# EAGLE design piezo-driver_v0.4-R001 (EAGLE 6.5.0)
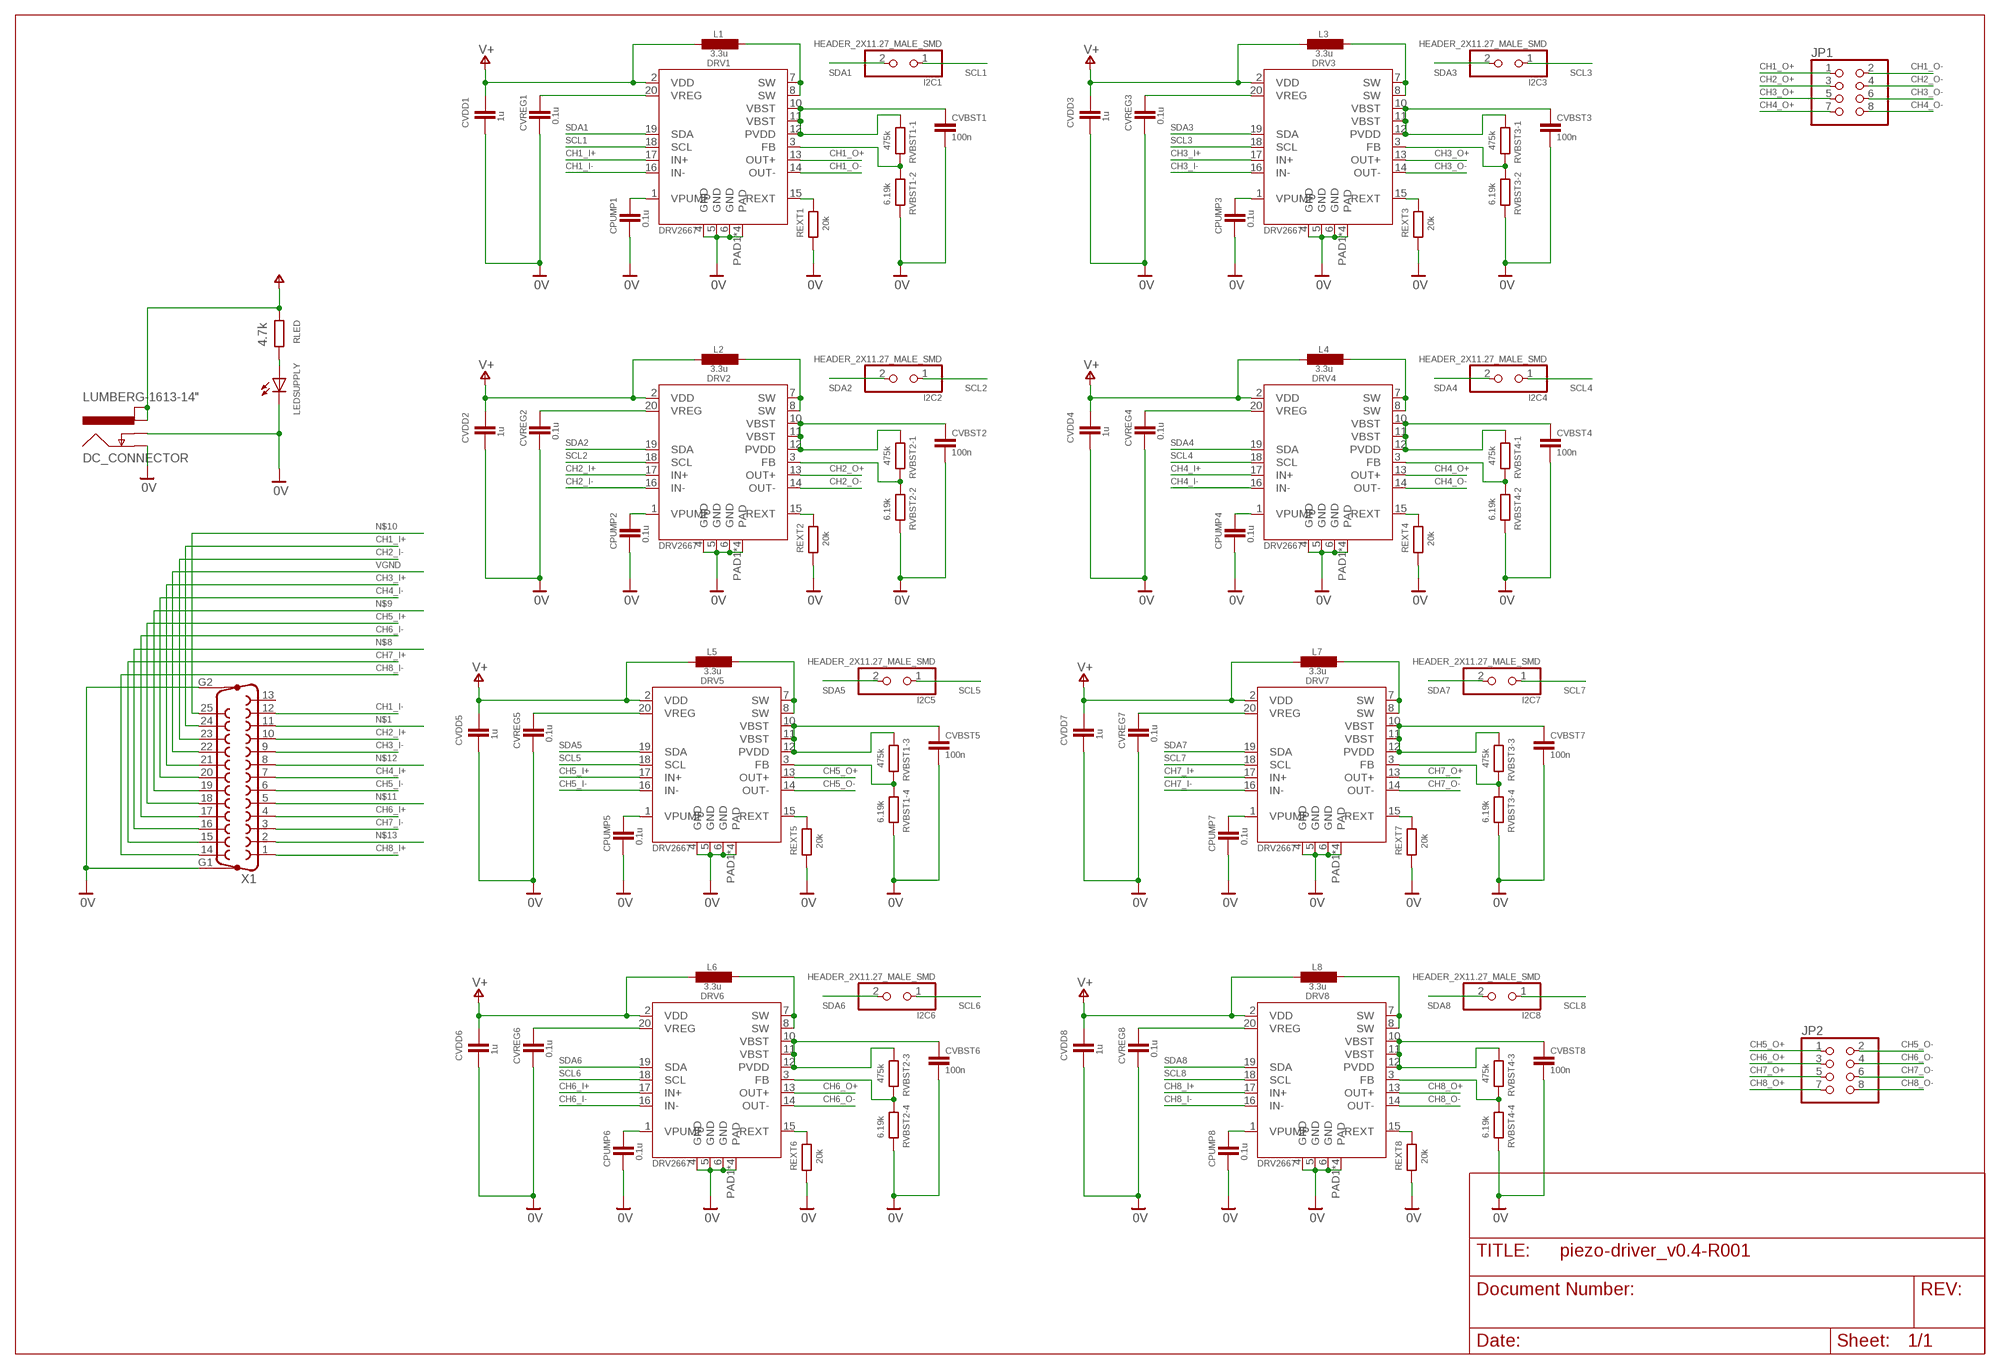
[diagram p0: schematic, sheet 1]

## Parts
CPUMP1  0.1u  C-EUC0805  [C0805]
CPUMP2  0.1u  C-EUC0805  [C0805]
CPUMP3  0.1u  C-EUC0805  [C0805]
CPUMP4  0.1u  C-EUC0805  [C0805]
CPUMP5  0.1u  C-EUC0805  [C0805]
CPUMP6  0.1u  C-EUC0805  [C0805]
CPUMP7  0.1u  C-EUC0805  [C0805]
CPUMP8  0.1u  C-EUC0805  [C0805]
CVBST1  100n  C-EUC0805  [C0805]
CVBST2  100n  C-EUC0805  [C0805]
CVBST3  100n  C-EUC0805  [C0805]
CVBST4  100n  C-EUC0805  [C0805]
CVBST5  100n  C-EUC0805  [C0805]
CVBST6  100n  C-EUC0805  [C0805]
CVBST7  100n  C-EUC0805  [C0805]
CVBST8  100n  C-EUC0805  [C0805]
CVDD1  1u  C-EUC0805  [C0805]
CVDD2  1u  C-EUC0805  [C0805]
CVDD3  1u  C-EUC0805  [C0805]
CVDD4  1u  C-EUC0805  [C0805]
CVDD5  1u  C-EUC0805  [C0805]
CVDD6  1u  C-EUC0805  [C0805]
CVDD7  1u  C-EUC0805  [C0805]
CVDD8  1u  C-EUC0805  [C0805]
CVREG1  0.1u  C-EUC0805  [C0805]
CVREG2  0.1u  C-EUC0805  [C0805]
CVREG3  0.1u  C-EUC0805  [C0805]
CVREG4  0.1u  C-EUC0805  [C0805]
CVREG5  0.1u  C-EUC0805  [C0805]
CVREG6  0.1u  C-EUC0805  [C0805]
CVREG7  0.1u  C-EUC0805  [C0805]
CVREG8  0.1u  C-EUC0805  [C0805]
DC_CONNECTOR  LUMBERG-1613-14"  [LUMBERG-1613_14]
DRV1  DRV2667QFN  [QFN400X400]
DRV2  DRV2667QFN  [QFN400X400]
DRV3  DRV2667QFN  [QFN400X400]
DRV4  DRV2667QFN  [QFN400X400]
DRV5  DRV2667QFN  [QFN400X400]
DRV6  DRV2667QFN  [QFN400X400]
DRV7  DRV2667QFN  [QFN400X400]
DRV8  DRV2667QFN  [QFN400X400]
I2C1  HEADER_2X11.27_MALE_SMD  [2X01_1.27_SMD]
I2C2  HEADER_2X11.27_MALE_SMD  [2X01_1.27_SMD]
I2C3  HEADER_2X11.27_MALE_SMD  [2X01_1.27_SMD]
I2C4  HEADER_2X11.27_MALE_SMD  [2X01_1.27_SMD]
I2C5  HEADER_2X11.27_MALE_SMD  [2X01_1.27_SMD]
I2C6  HEADER_2X11.27_MALE_SMD  [2X01_1.27_SMD]
I2C7  HEADER_2X11.27_MALE_SMD  [2X01_1.27_SMD]
I2C8  HEADER_2X11.27_MALE_SMD  [2X01_1.27_SMD]
JP1  PINHD-2X4/90  [2X04/90]
JP2  PINHD-2X4/90  [2X04/90]
L1  3.3u  L-EUL3225M  [L3225M]
L2  3.3u  L-EUL3225M  [L3225M]
L3  3.3u  L-EUL3225M  [L3225M]
L4  3.3u  L-EUL3225M  [L3225M]
L5  3.3u  L-EUL3225M  [L3225M]
L6  3.3u  L-EUL3225M  [L3225M]
L7  3.3u  L-EUL3225M  [L3225M]
L8  3.3u  L-EUL3225M  [L3225M]
LEDSUPPLY  LED0603  [LED-0603]
REXT1  20k  R-EU_R0805  [R0805]
REXT2  20k  R-EU_R0805  [R0805]
REXT3  20k  R-EU_R0805  [R0805]
REXT4  20k  R-EU_R0805  [R0805]
REXT5  20k  R-EU_R0805  [R0805]
REXT6  20k  R-EU_R0805  [R0805]
REXT7  20k  R-EU_R0805  [R0805]
REXT8  20k  R-EU_R0805  [R0805]
RLED  4.7k  R-EU_R0805  [R0805]
RVBST1-1  475k  R-EU_R0805  [R0805]
RVBST1-2  6.19k  R-EU_R0805  [R0805]
RVBST1-3  475k  R-EU_R0805  [R0805]
RVBST1-4  6.19k  R-EU_R0805  [R0805]
RVBST2-1  475k  R-EU_R0805  [R0805]
RVBST2-2  6.19k  R-EU_R0805  [R0805]
RVBST2-3  475k  R-EU_R0805  [R0805]
RVBST2-4  6.19k  R-EU_R0805  [R0805]
RVBST3-1  475k  R-EU_R0805  [R0805]
RVBST3-2  6.19k  R-EU_R0805  [R0805]
RVBST3-3  475k  R-EU_R0805  [R0805]
RVBST3-4  6.19k  R-EU_R0805  [R0805]
RVBST4-1  475k  R-EU_R0805  [R0805]
RVBST4-2  6.19k  R-EU_R0805  [R0805]
RVBST4-3  475k  R-EU_R0805  [R0805]
RVBST4-4  6.19k  R-EU_R0805  [R0805]
X1  F25HP  [F25HP]

## Nets
0V: CPUMP1.2 CPUMP2.2 CPUMP3.2 CPUMP4.2 CPUMP5.2 CPUMP6.2 CPUMP7.2 CPUMP8.2 CVBST1.2 CVBST2.2 CVBST3.2 CVBST4.2 CVBST5.2 CVBST6.2 CVBST7.2 CVBST8.2 CVDD1.2 CVDD2.2 CVDD3.2 CVDD4.2 CVDD5.2 CVDD6.2 CVDD7.2 CVDD8.2 CVREG1.2 CVREG2.2 CVREG3.2 CVREG4.2 CVREG5.2 CVREG6.2 CVREG7.2 CVREG8.2 DC_CONNECTOR.1(GND) DC_CONNECTOR.2(GND_INS) DRV1.4(GND) DRV1.5(GND) DRV1.6(GND) DRV1.PAD1(PAD) DRV1.PAD2(PAD) DRV1.PAD3(PAD) DRV1.PAD4(PAD) DRV2.4(GND) DRV2.5(GND) DRV2.6(GND) DRV2.PAD1(PAD) DRV2.PAD2(PAD) DRV2.PAD3(PAD) DRV2.PAD4(PAD) DRV3.4(GND) DRV3.5(GND) DRV3.6(GND) DRV3.PAD1(PAD) DRV3.PAD2(PAD) DRV3.PAD3(PAD) DRV3.PAD4(PAD) DRV4.4(GND) DRV4.5(GND) DRV4.6(GND) DRV4.PAD1(PAD) DRV4.PAD2(PAD) DRV4.PAD3(PAD) DRV4.PAD4(PAD) DRV5.4(GND) DRV5.5(GND) DRV5.6(GND) DRV5.PAD1(PAD) DRV5.PAD2(PAD) DRV5.PAD3(PAD) DRV5.PAD4(PAD) DRV6.4(GND) DRV6.5(GND) DRV6.6(GND) DRV6.PAD1(PAD) DRV6.PAD2(PAD) DRV6.PAD3(PAD) DRV6.PAD4(PAD) DRV7.4(GND) DRV7.5(GND) DRV7.6(GND) DRV7.PAD1(PAD) DRV7.PAD2(PAD) DRV7.PAD3(PAD) DRV7.PAD4(PAD) DRV8.4(GND) DRV8.5(GND) DRV8.6(GND) DRV8.PAD1(PAD) DRV8.PAD2(PAD) DRV8.PAD3(PAD) DRV8.PAD4(PAD) LEDSUPPLY.C REXT1.1 REXT2.1 REXT3.1 REXT4.1 REXT5.1 REXT6.1 REXT7.1 REXT8.1 RVBST1-2.1 RVBST1-4.1 RVBST2-2.1 RVBST2-4.1 RVBST3-2.1 RVBST3-4.1 RVBST4-2.1 RVBST4-4.1 X1.G1 X1.G2
CH1_I+: DRV1.17(IN+) X1.24
CH1_I-: DRV1.16(IN-) X1.12
CH1_O+: DRV1.13(OUT+) JP1.1
CH1_O-: DRV1.14(OUT-) JP1.2
CH2_I+: DRV2.17(IN+) X1.10
CH2_I-: DRV2.16(IN-) X1.23
CH2_O+: DRV2.13(OUT+) JP1.3
CH2_O-: DRV2.14(OUT-) JP1.4
CH3_I+: DRV3.17(IN+) X1.21
CH3_I-: DRV3.16(IN-) X1.9
CH3_O+: DRV3.13(OUT+) JP1.5
CH3_O-: DRV3.14(OUT-) JP1.6
CH4_I+: DRV4.17(IN+) X1.7
CH4_I-: DRV4.16(IN-) X1.20
CH4_O+: DRV4.13(OUT+) JP1.7
CH4_O-: DRV4.14(OUT-) JP1.8
CH5_I+: DRV5.17(IN+) X1.18
CH5_I-: DRV5.16(IN-) X1.6
CH5_O+: DRV5.13(OUT+) JP2.1
CH5_O-: DRV5.14(OUT-) JP2.2
CH6_I+: DRV6.17(IN+) X1.4
CH6_I-: DRV6.16(IN-) X1.17
CH6_O+: DRV6.13(OUT+) JP2.3
CH6_O-: DRV6.14(OUT-) JP2.4
CH7_I+: DRV7.17(IN+) X1.15
CH7_I-: DRV7.16(IN-) X1.3
CH7_O+: DRV7.13(OUT+) JP2.5
CH7_O-: DRV7.14(OUT-) JP2.6
CH8_I+: DRV8.17(IN+) X1.1
CH8_I-: DRV8.16(IN-) X1.14
CH8_O+: DRV8.13(OUT+) JP2.7
CH8_O-: DRV8.14(OUT-) JP2.8
N$1: X1.11
N$2: DRV1.7(SW) DRV1.8(SW) L1.1
N$3: CVBST1.1 DRV1.10(VBST) DRV1.11(VBST) DRV1.12(PVDD) RVBST1-1.2
N$4: DRV1.3(FB) RVBST1-1.1 RVBST1-2.2
N$5: DRV1.15(REXT) REXT1.2
N$6: CPUMP1.1 DRV1.1(VPUMP)
N$7: CVREG1.1 DRV1.20(VREG)
N$8: X1.16
N$9: X1.19
N$10: X1.25
N$11: X1.5
N$12: X1.8
N$13: X1.2
N$14: DRV2.7(SW) DRV2.8(SW) L2.1
N$15: LEDSUPPLY.A RLED.1
N$16: CVBST2.1 DRV2.10(VBST) DRV2.11(VBST) DRV2.12(PVDD) RVBST2-1.2
N$17: DRV2.3(FB) RVBST2-1.1 RVBST2-2.2
N$18: DRV2.15(REXT) REXT2.2
N$19: CPUMP2.1 DRV2.1(VPUMP)
N$20: CVREG2.1 DRV2.20(VREG)
N$21: DRV3.7(SW) DRV3.8(SW) L3.1
N$22: CVBST3.1 DRV3.10(VBST) DRV3.11(VBST) DRV3.12(PVDD) RVBST3-1.2
N$23: DRV3.3(FB) RVBST3-1.1 RVBST3-2.2
N$24: DRV3.15(REXT) REXT3.2
N$25: CPUMP3.1 DRV3.1(VPUMP)
N$26: CVREG3.1 DRV3.20(VREG)
N$27: DRV4.7(SW) DRV4.8(SW) L4.1
N$28: CVBST4.1 DRV4.10(VBST) DRV4.11(VBST) DRV4.12(PVDD) RVBST4-1.2
N$29: DRV4.3(FB) RVBST4-1.1 RVBST4-2.2
N$30: DRV4.15(REXT) REXT4.2
N$31: CPUMP4.1 DRV4.1(VPUMP)
N$32: CVREG4.1 DRV4.20(VREG)
N$33: DRV5.7(SW) DRV5.8(SW) L5.1
N$34: CVBST5.1 DRV5.10(VBST) DRV5.11(VBST) DRV5.12(PVDD) RVBST1-3.2
N$35: DRV5.3(FB) RVBST1-3.1 RVBST1-4.2
N$36: DRV5.15(REXT) REXT5.2
N$37: CPUMP5.1 DRV5.1(VPUMP)
N$38: CVREG5.1 DRV5.20(VREG)
N$39: DRV6.7(SW) DRV6.8(SW) L6.1
N$40: CVBST6.1 DRV6.10(VBST) DRV6.11(VBST) DRV6.12(PVDD) RVBST2-3.2
N$41: DRV6.3(FB) RVBST2-3.1 RVBST2-4.2
N$42: DRV6.15(REXT) REXT6.2
N$43: CPUMP6.1 DRV6.1(VPUMP)
N$44: CVREG6.1 DRV6.20(VREG)
N$45: DRV7.7(SW) DRV7.8(SW) L7.1
N$46: CVBST7.1 DRV7.10(VBST) DRV7.11(VBST) DRV7.12(PVDD) RVBST3-3.2
N$47: DRV7.3(FB) RVBST3-3.1 RVBST3-4.2
N$48: DRV7.15(REXT) REXT7.2
N$49: CPUMP7.1 DRV7.1(VPUMP)
N$50: CVREG7.1 DRV7.20(VREG)
N$51: DRV8.7(SW) DRV8.8(SW) L8.1
N$52: CVBST8.1 DRV8.10(VBST) DRV8.11(VBST) DRV8.12(PVDD) RVBST4-3.2
N$53: DRV8.3(FB) RVBST4-3.1 RVBST4-4.2
N$54: DRV8.15(REXT) REXT8.2
N$55: CPUMP8.1 DRV8.1(VPUMP)
N$56: CVREG8.1 DRV8.20(VREG)
SCL1: DRV1.18(SCL) I2C1.1
SCL2: DRV2.18(SCL) I2C2.1
SCL3: DRV3.18(SCL) I2C3.1
SCL4: DRV4.18(SCL) I2C4.1
SCL5: DRV5.18(SCL) I2C5.1
SCL6: DRV6.18(SCL) I2C6.1
SCL7: DRV7.18(SCL) I2C7.1
SCL8: DRV8.18(SCL) I2C8.1
SDA1: DRV1.19(SDA) I2C1.2
SDA2: DRV2.19(SDA) I2C2.2
SDA3: DRV3.19(SDA) I2C3.2
SDA4: DRV4.19(SDA) I2C4.2
SDA5: DRV5.19(SDA) I2C5.2
SDA6: DRV6.19(SDA) I2C6.2
SDA7: DRV7.19(SDA) I2C7.2
SDA8: DRV8.19(SDA) I2C8.2
V+: CVDD1.1 CVDD2.1 CVDD3.1 CVDD4.1 CVDD5.1 CVDD6.1 CVDD7.1 CVDD8.1 DC_CONNECTOR.3(PWR_1) DC_CONNECTOR.4(PWR_2) DRV1.2(VDD) DRV2.2(VDD) DRV3.2(VDD) DRV4.2(VDD) DRV5.2(VDD) DRV6.2(VDD) DRV7.2(VDD) DRV8.2(VDD) L1.2 L2.2 L3.2 L4.2 L5.2 L6.2 L7.2 L8.2 RLED.2
VGND: X1.22
Unconnected: X1.13

## Library data of the parts
CPUMP1-CPUMP8 CVBST1-CVBST8 CVDD1-CVDD8 CVREG1-CVREG8 = SABRe:C-EU: CAPACITOR, European symbol
DC_CONNECTOR = SABRe:LUMBERG-1613-14
DRV1-DRV8 = ICST:DRV2667
I2C1-I2C8 = SABRe:HEADER_2X1
JP1 JP2 = ICST:PINHD-2X4: PIN HEADER
L1-L8 = SABRe:L-EU: INDUCTOR, European symbol
LEDSUPPLY = SABRe:LED: LEDs Standard schematic elements and footprints for packages: 5mm 3mm 1206 0603
REXT1-REXT8 RVBST1-1-RVBST1-4 RVBST2-1-RVBST2-4 RVBST3-1-RVBST3-4 RVBST4-1-RVBST4-4 = SABRe:R-EU_: RESISTOR, European symbol
RLED = rcl:R-EU_: RESISTOR, European symbol
X1 = ICST:F25HP: SUB-D; OC_FARNELL: unknown; OC_NEWARK: unknown

## Board
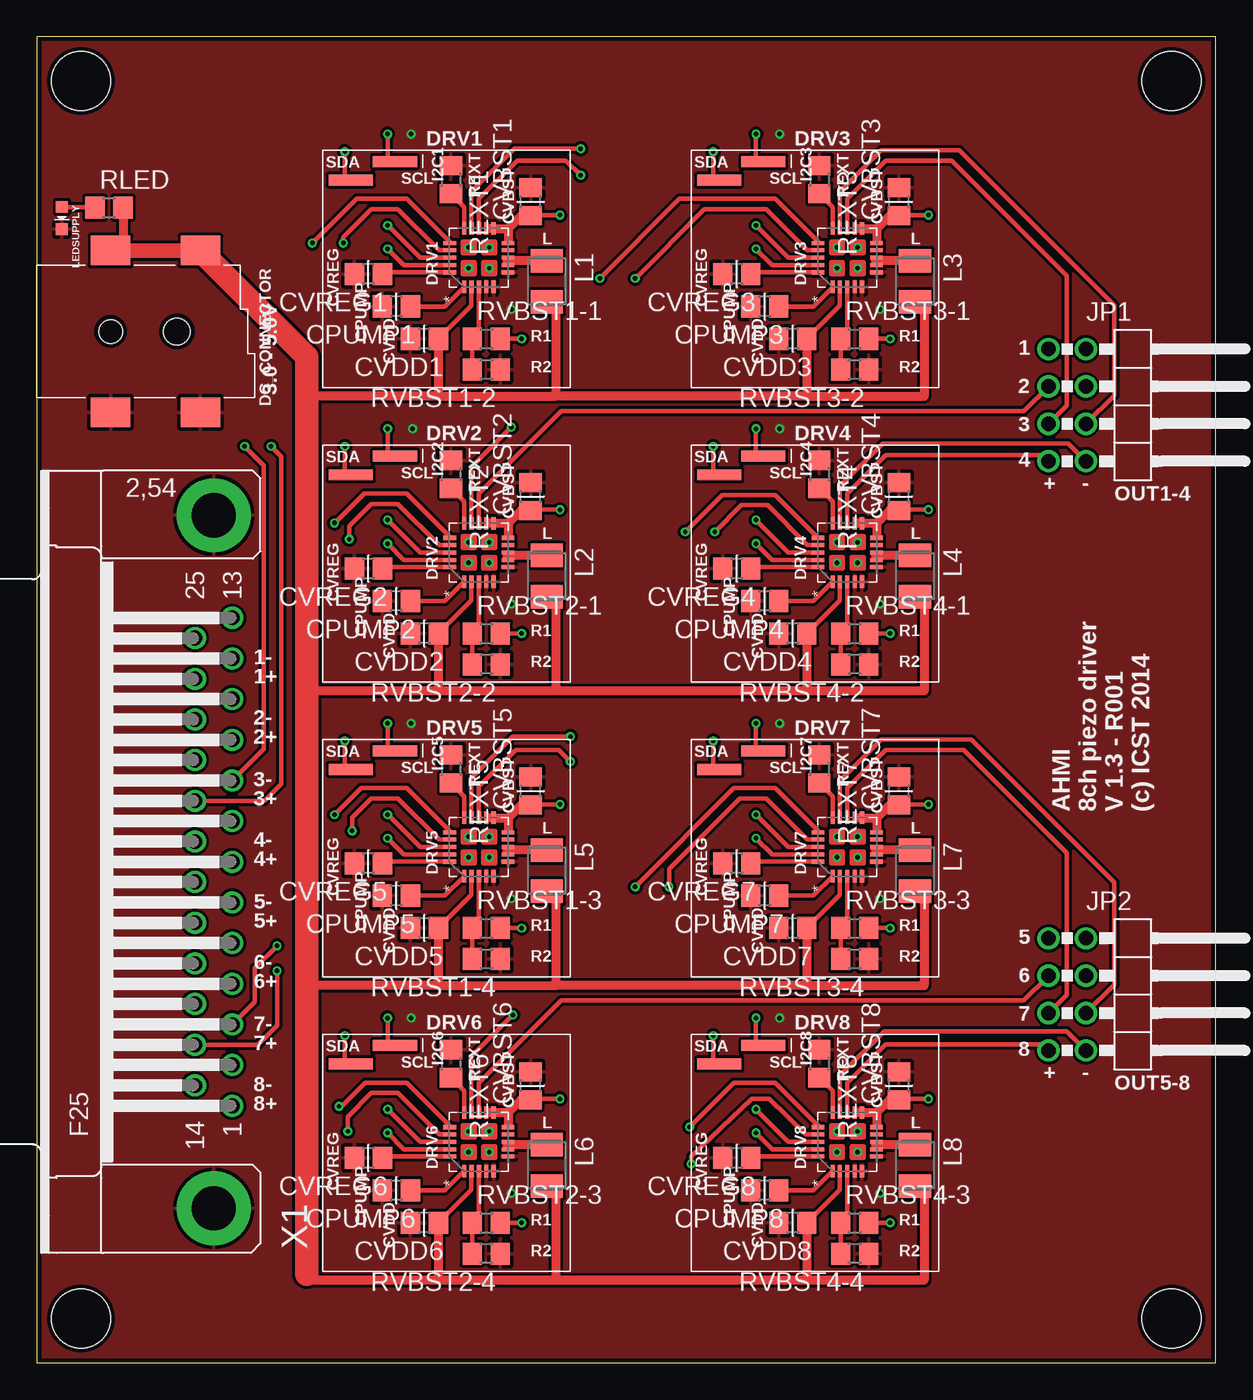
[diagram p1: board, top side]
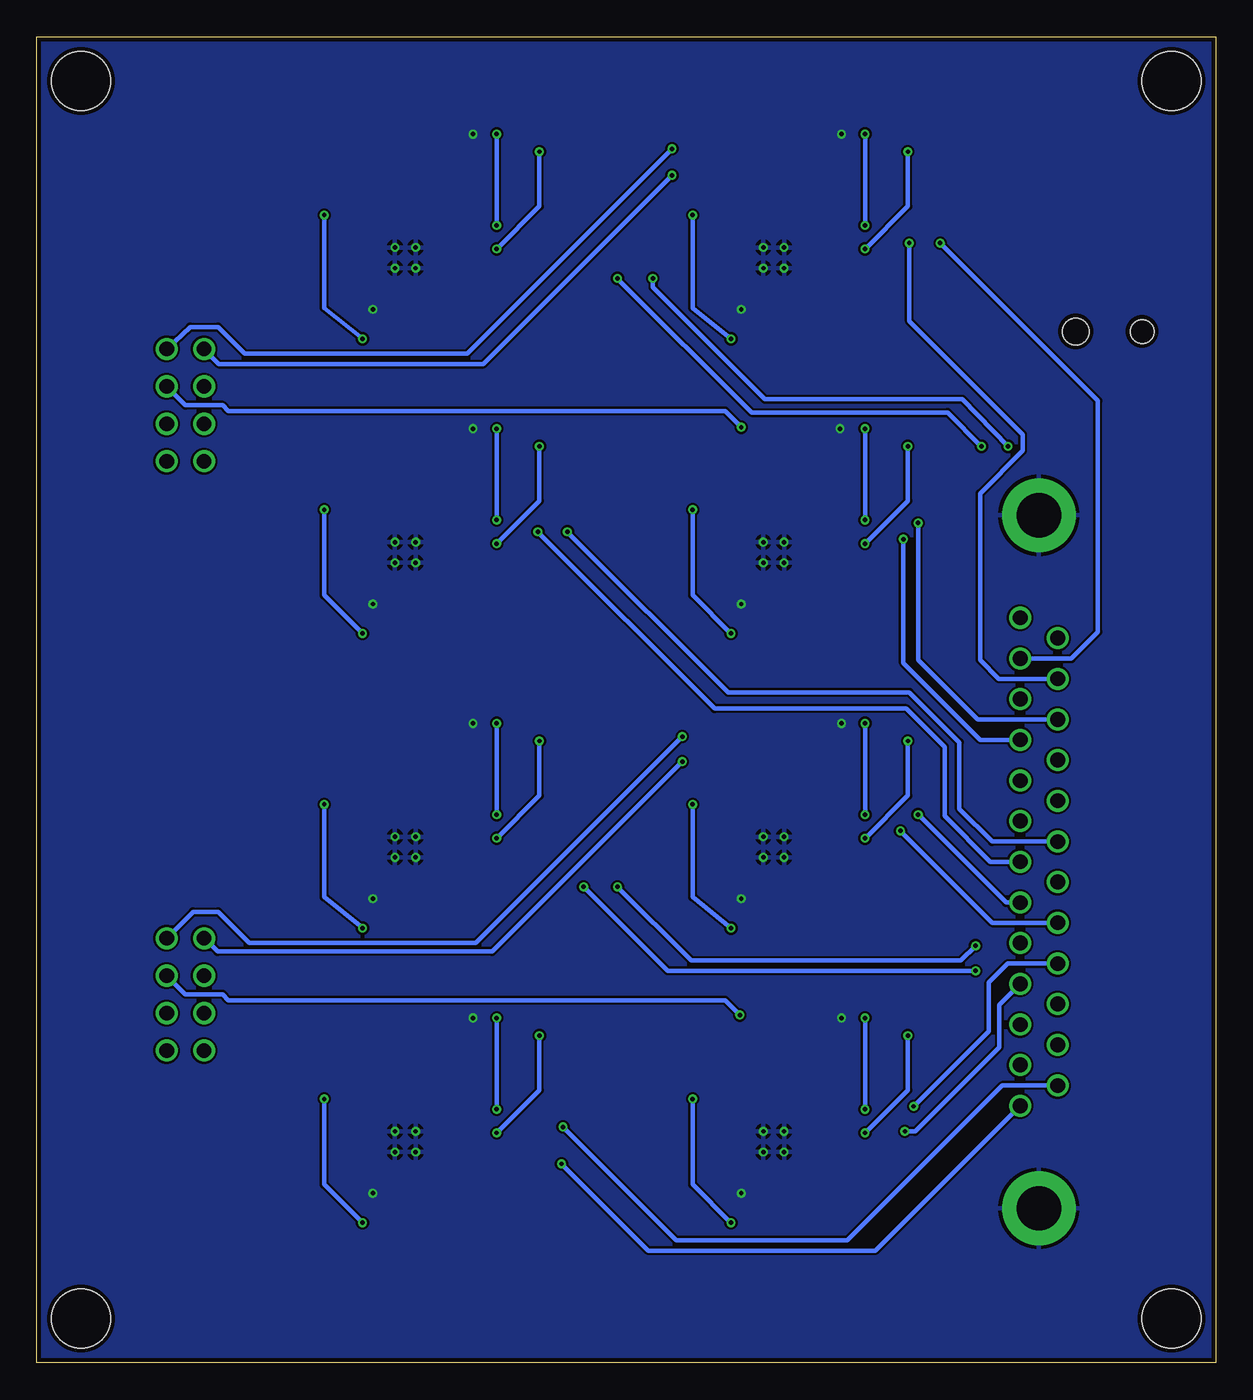
[diagram p2: board, bottom side, seen from below]

Size 80 x 90 mm. Coordinates in mm from the lower left corner, seen from the top.
Outline: 0,90 0,0 80,0 80,90 0,90
Copper layers (1*16): Top 0.035mm / dielectric 1.5mm / Bottom 0.035mm
Design rules "2L-1.6mm-0.15_0.3mm *": minimum track width 0.15mm, minimum drill 0.3mm, track to track 0.15mm, track to pad 0.15mm, pad to pad 0.15mm, via to via 0.15mm, smd to smd 0.15mm, copper to edge 0.3mm, drill to drill 0.5mm, minimum pad ring 0.15mm, minimum via ring 0.15mm, stop-mask expansion 0.1mm, vias tented up to drill 0.8mm, thermal gap 0.25mm
Holes 4 mm at 3,87 77,87 77,3 3,3

### Footprints (pad centres in the part's own frame; a part is rotated, then mirrored left to right if it is on the bottom)
C0805 = smd 1.3 x 1.5: 1 -0.95,0; 2 0.95,0
LUMBERG-1613_14 = smd 2 x 2.7: 1 5.5,5; 2 5.5,11.1; 3 -5.5,11.1; 4 -5.5,5 | hole 1.6: 0,5 | hole 1.8: 0,9.5
QFN400X400 = smd 0.85 x 0.28: 1 -1.981,0.991; 2 -1.981,0.508; 3 -1.981,0; 4 -1.981,-0.508; 5 -1.981,-0.991; 11 1.981,-0.991; 12 1.981,-0.508; 13 1.981,0; 14 1.981,0.508; 15 1.981,0.991 | smd 0.28 x 0.85: 6 -0.991,-1.981; 7 -0.508,-1.981; 8 0,-1.981; 9 0.508,-1.981; 10 0.991,-1.981; 16 0.991,1.981; 17 0.508,1.981; 18 0,1.981; 19 -0.508,1.981; 20 -0.991,1.981 | drill 0.3: PAD1 -0.7,0.7; PAD2 0.7,0.7; PAD3 -0.7,-0.7; PAD4 0.7,-0.7
2X01_1.27_SMD = smd 0.74 x 3: 1 -0.63,1.5; 2 0.63,-1.5
2X04/90 = drill 1: 1 -3.81,-6.35; 2 -3.81,-3.81; 3 -1.27,-6.35; 4 -1.27,-3.81; 5 1.27,-6.35; 6 1.27,-3.81; 7 3.81,-6.35; 8 3.81,-3.81
L3225M = smd 1.6 x 2.2: 1 -1.4,0; 2 1.4,0
LED-0603 = smd 0.8 x 0.8: A 0,-0.75; C 0,0.75
R0805 = smd 1.3 x 1.5: 1 -0.95,0; 2 0.95,0
F25HP = drill 1: 1 -16.561,-1.27; 2 -13.792,-1.27; 3 -11.049,-1.27; 4 -8.28,-1.27; 5 -5.512,-1.27; 6 -2.769,-1.27; 7 0,-1.27; 8 2.769,-1.27; 9 5.512,-1.27; 10 8.28,-1.27; 11 11.049,-1.27; 12 13.792,-1.27; 13 16.561,-1.27; 14 -15.189,1.27; 15 -12.421,1.27; 16 -9.652,1.27; 17 -6.909,1.27; 18 -4.14,1.27; 19 -1.372,1.27; 20 1.372,1.27; 21 4.14,1.27; 22 6.909,1.27; 23 9.652,1.27; 24 12.421,1.27; 25 15.189,1.27 | drill 3 pad 5: G1 -23.52,0; G2 23.52,0

### Placement (x,y rotation side)
CPUMP1  24.4,71.7 180 top
CPUMP2  24.4,51.7 180 top
CPUMP3  49.4,71.7 180 top
CPUMP4  49.4,51.7 180 top
CPUMP5  24.4,31.7 180 top
CPUMP6  24.4,11.7 180 top
CPUMP7  49.4,31.7 180 top
CPUMP8  49.4,11.7 180 top
CVBST1  33.5,78.8 90 top
CVBST2  33.5,58.8 90 top
CVBST3  58.5,78.8 90 top
CVBST4  58.5,58.8 90 top
CVBST5  33.5,38.8 90 top
CVBST6  33.5,18.8 90 top
CVBST7  58.5,38.8 90 top
CVBST8  58.5,18.8 90 top
CVDD1  26.3,69.5 180 top
CVDD2  26.3,49.5 180 top
CVDD3  51.3,69.5 180 top
CVDD4  51.3,49.5 180 top
CVDD5  26.3,29.5 180 top
CVDD6  26.3,9.5 180 top
CVDD7  51.3,29.5 180 top
CVDD8  51.3,9.5 180 top
CVREG1  22.5,73.9 180 top
CVREG2  22.5,53.9 180 top
CVREG3  47.5,73.9 180 top
CVREG4  47.5,53.9 180 top
CVREG5  22.5,33.9 180 top
CVREG6  22.5,13.9 180 top
CVREG7  47.5,33.9 180 top
CVREG8  47.5,13.9 180 top
DC_CONNECTOR  0,70 270 top
DRV1  30,75 90 top
DRV2  30,55 90 top
DRV3  55,75 90 top
DRV4  55,55 90 top
DRV5  30,35 90 top
DRV6  30,15 90 top
DRV7  55,35 90 top
DRV8  55,15 90 top
I2C1  22.8,80.9 270 top
I2C2  22.8,60.9 270 top
I2C3  47.8,80.9 270 top
I2C4  47.8,60.9 270 top
I2C5  22.8,40.9 270 top
I2C6  22.8,20.9 270 top
I2C7  47.8,40.9 270 top
I2C8  47.8,20.9 270 top
JP1  75,65 270 top
JP2  75,25 270 top
L1  34.6,73.4 270 top
L2  34.6,53.4 270 top
L3  59.6,73.4 270 top
L4  59.6,53.4 270 top
L5  34.6,33.4 270 top
L6  34.6,13.4 270 top
L7  59.6,33.4 270 top
L8  59.6,13.4 270 top
LEDSUPPLY  1.7,77.7 180 top
REXT1  28.1,80.3 270 top
REXT2  28.1,60.3 270 top
REXT3  53.1,80.3 270 top
REXT4  53.1,60.3 270 top
REXT5  28.1,40.3 270 top
REXT6  28.1,20.3 270 top
REXT7  53.1,40.3 270 top
REXT8  53.1,20.3 270 top
RLED  4.9,78.4 0 top
RVBST1-1  30.5,69.5 0 top
RVBST1-2  30.5,67.4 180 top
RVBST1-3  30.5,29.5 0 top
RVBST1-4  30.5,27.4 180 top
RVBST2-1  30.5,49.5 0 top
RVBST2-2  30.5,47.4 180 top
RVBST2-3  30.5,9.5 0 top
RVBST2-4  30.5,7.4 180 top
RVBST3-1  55.5,69.5 0 top
RVBST3-2  55.5,67.4 180 top
RVBST3-3  55.5,29.5 0 top
RVBST3-4  55.5,27.4 180 top
RVBST4-1  55.5,49.5 0 top
RVBST4-2  55.5,47.4 180 top
RVBST4-3  55.5,9.5 0 top
RVBST4-4  55.5,7.4 180 top
X1  12,34 90 top

### Tracks (layer width: path | path; a pad name or v marks a point on that pad's centre or on a via)
0V  (via drill 0.3)
  other vias: 32.2,71.5 32.2,51.5 57.2,71.5 57.2,51.5 32.2,31.5 32.2,11.5 57.2,31.5 57.2,11.5 25.5,63.4 25.4,23.4 50.4,23.4 50.4,43.4 25.4,43.4 50.4,63.4 25.4,83.4 50.4,83.4
  pour Top (isolate 0.2): 0,90 0,0 80,0 80,90
  pour Bottom: 0,90 0,0 80,0 80,90
CH1_I+  (via drill 0.3)
  Top 0.3: DRV1.17 27.29,75.51 24.5,78.3 22.7,78.3 20.8,76.4 v20.8,76
  Bottom 0.3: X1.24 14.72,46.42 16,47.7 16,59 13.1,61.9 13.1,63 20.8,70.7 v20.8,76
CH1_I-  (via drill 0.3)
  Top 0.3: DRV1.16 28.02,76.08 25.1,79 21.7,79 v18.7,76
  Bottom 0.3: X1.12 9.81,47.79 8,49.6 8,65.3 v18.7,76
CH1_O+  (via drill 0.3)
  Top 0.3: DRV1.13 30,79 32.6,81.6 35.9,81.6 v36.9,80.6
  Bottom 0.3: JP1.1 67.64,67.8 49.7,67.8 v36.9,80.6
CH1_O-  (via drill 0.3)
  Top 0.3: DRV1.14 29.49,79.49 32.4,82.4 v36.9,82.4
  Bottom 0.3: JP1.2 69.6,70.3 67.7,70.3 65.9,68.5 50.8,68.5 v36.9,82.4
CH2_I+  (via drill 0.3)
  Top 0.3: DRV2.17 27.29,55.51 24.5,58.3 22.7,58.3 21.2,56.8 v21.2,55.9
  Bottom 0.3: X1.10 15.98,42.28 21.2,47.5 v21.2,55.9
CH2_I-  (via drill 0.3)
  Top 0.3: DRV2.16 28.02,56.08 25.1,59 22.2,59 v20.2,57
  Bottom 0.3: X1.23 16.15,43.65 20.2,47.7 v20.2,57
CH2_O+
  Top 0.3: DRV2.13 30,59 35.6,64.6 66.98,64.6 JP1.3
CH2_O-  (via drill 0.3)
  Top 0.3: DRV2.14 29.49,60.79 v32.2,63.5
  Bottom 0.3: v32.2,63.5 33.3,64.6 67,64.6 67.4,65 69.92,65 JP1.4
CH3_I+  (via drill 0.3)
  Top 0.3: DRV3.17 52.29,75.51 49.5,78.3 45.3,78.3 v40.6,73.6 | X1.21 15.44,38.14 16.6,39.3 16.6,61.5 v15.9,62.2
  Bottom 0.3: v40.6,73.6 31.5,64.5 18.2,64.5 v15.9,62.2
CH3_I-  (via drill 0.3)
  Top 0.3: DRV3.16 53.02,76.08 50.1,79 43.6,79 v38.2,73.6 | X1.9 15.4,41.64 15.4,60.9 v14.1,62.2
  Bottom 0.3: v38.2,73.6 38.2,73 30.6,65.4 17.2,65.4 v14.1,62.2
CH3_O+
  Top 0.3: DRV3.13 55,79 57.6,81.6 59.8,81.6 60.1,81.6 62.1,81.6 69.9,73.8 69.9,64.98 JP1.5
CH3_O-
  Top 0.3: DRV3.14 54.49,79.49 57.3,82.3 58.5,82.3 60.2,82.3 62.6,82.3 73.1,71.8 73.1,65.64 JP1.6
CH4_I+  (via drill 0.3)
  Top 0.3: DRV4.17 52.29,55.51 49.6,58.2 47.8,58.2 v46,56.4
  Bottom 0.3: X1.7 15.3,34 18.4,37.1 18.4,41.8 21,44.4 34,44.4 v46,56.4
CH4_I-  (via drill 0.3)
  Top 0.3: DRV4.16 50.11,58.9 46.5,58.9 v44,56.4
  Bottom 0.3: X1.20 15.17,35.37 17.4,37.6 17.4,42.1 20.8,45.5 33.1,45.5 v44,56.4
CH4_O+
  Top 0.3: DRV4.13 55,59 57.6,61.6 68.24,61.6 JP1.7
CH4_O-
  Top 0.3: DRV4.14 54.49,59.49 57.4,62.4 69.98,62.4 JP1.8
CH5_I+  (via drill 0.3)
  Top 0.3: DRV5.17 27.29,35.51 24.5,38.3 22.7,38.3 21.4,37 v21.4,36.1
  Bottom 0.3: v21.4,36.1 15.16,29.86 X1.18
CH5_I-  (via drill 0.3)
  Top 0.3: DRV5.16 28.02,36.08 25.1,39 22,39 v20.2,37.2
  Bottom 0.3: v20.2,37.2 14.23,31.23 X1.6
CH5_O+  (via drill 0.3)
  Top 0.3: DRV5.13 30,39.1 32.5,41.6 35.4,41.6 v36.2,40.8
  Bottom 0.3: v36.2,40.8 49.1,27.9 67.74,27.9 JP2.1
CH5_O-  (via drill 0.3)
  Top 0.3: DRV5.14 29.49,39.69 32.3,42.5 v36.2,42.5
  Bottom 0.3: v36.2,42.5 50.2,28.5 65.6,28.5 67.7,30.6 69.4,30.6 JP2.2
CH6_I+  (via drill 0.3)
  Top 0.3: DRV6.17 27.29,15.51 24.5,18.3 22.7,18.3 21.1,16.7 v21.1,15.7
  Bottom 0.3: X1.4 14.7,24.29 14.7,21.4 20.4,15.7 v21.1,15.7
CH6_I-  (via drill 0.3)
  Top 0.3: DRV6.16 28.02,16.08 25.1,19 22.3,19 20.6,17.3 v20.5,17.4
  Bottom 0.3: v20.5,17.4 15.4,22.5 15.4,25.8 14.11,27.09 X1.17
CH6_O+
  Top 0.3: DRV6.13 30,19 35.6,24.6 66.98,24.6 JP2.3
CH6_O-  (via drill 0.3)
  Top 0.3: DRV6.14 29.49,20.79 v32.3,23.6
  Bottom 0.3: v32.3,23.6 33.3,24.6 67,24.6 67.4,25 69.92,25 JP2.4
CH7_I+  (via drill 0.3)
  Top 0.3: DRV7.17 52.29,35.51 49.5,38.3 47.7,38.3 42.9,33.5 v42.9,32.3 | X1.15 14.98,21.58 16.3,22.9 v16.3,26.6
  Bottom 0.3: v16.3,26.6 37.2,26.6 v42.9,32.3
CH7_I-  (via drill 0.3)
  Top 0.3: DRV7.16 53.02,36.08 50.1,39 47.3,39 v40.6,32.3 | X1.3 14.8,24.48 14.8,26.8 v16.3,28.3
  Bottom 0.3: v40.6,32.3 35.6,27.3 17.3,27.3 v16.3,28.3
CH7_O+
  Top 0.3: DRV7.13 55,39 57.6,41.6 62.9,41.6 69.9,34.6 69.9,24.98 JP2.5
CH7_O-
  Top 0.3: DRV7.14 54.49,39.49 57.3,42.3 63.4,42.3 73.1,32.6 73.1,25.64 JP2.6
CH8_I+  (via drill 0.3)
  Top 0.3: DRV8.17 52.19,15.51 49.7,17.9 48.5,17.9 44.4,14 v44.4,13.5
  Bottom 0.3: X1.1 23.11,7.6 38.5,7.6 v44.4,13.5
CH8_I-  (via drill 0.3)
  Top 0.3: DRV8.16 53.02,16.08 50.1,19 47.3,19 46,17.7 45.6,17.3 v44.3,16
  Bottom 0.3: X1.14 14.49,18.81 25,8.3 36.6,8.3 v44.3,16
CH8_O+
  Top 0.3: DRV8.13 55,19 57.6,21.6 68.24,21.6 JP2.7
CH8_O-
  Top 0.3: DRV8.14 54.49,19.49 57.5,22.5 69.88,22.5 JP2.8
N$2
  Top 0.3: DRV1.7 DRV1.8 32,74.98 32,74.8
  Top 0.6: L1.1 32,74.8 31.9,74.8
N$3  (via drill 0.3)
  Top 0.3: DRV1.11 30.99,77 | RVBST1-1.2 v32.9,69.5 | v35.5,77.9 33.5,77.9 CVBST1.1 | 30.7,76.98 DRV1.12 | 32,76.2 31.98,76.18 DRV1.10
  Top 0.6: 32,76.98 DRV1.11 30.7,76.98 | 32,76.98 32,76.2 | 32,76.98 32.87,77.85 CVBST1.1
  Bottom 0.3: v32.9,69.5 35.5,71.6 v35.5,77.9
N$4
  Top 0.3: DRV1.3 30,69.9 RVBST1-1.1 RVBST1-2.2
N$5
  Top 0.3: DRV1.15 29.01,78.44 REXT1.2
N$6
  Top 0.3: DRV1.1 27.69,71.7 CPUMP1.1
N$7
  Top 0.3: DRV1.20 23.15,74.01 CVREG1.1
N$14
  Top 0.3: DRV2.7 DRV2.8 32,54.98 32,54.8
  Top 0.6: L2.1 32,54.8 31.9,54.8
N$15
  Top 0.3: RLED.1 3.9,78.45 LEDSUPPLY.A
N$16  (via drill 0.3)
  Top 0.3: DRV2.11 30.99,57 | v35.5,57.9 33.5,57.9 CVBST2.1 | 30.7,56.98 DRV2.12 | 32,56.2 31.98,56.18 DRV2.10 | v32.9,49.5 RVBST2-1.2
  Top 0.6: 32,56.98 DRV2.11 30.7,56.98 | 32,56.98 32,56.2 | 32,56.98 32.87,57.85 CVBST2.1
  Bottom 0.3: v32.9,49.5 35.5,52.1 v35.5,57.9
N$17
  Top 0.3: DRV2.3 30,49.9 RVBST2-1.1 RVBST2-2.2
N$18
  Top 0.3: DRV2.15 29.01,58.44 REXT2.2
N$19
  Top 0.3: DRV2.1 27.69,51.7 CPUMP2.1
N$20
  Top 0.3: DRV2.20 23.15,54.01 CVREG2.1
N$21
  Top 0.3: DRV3.7 DRV3.8 57,74.98 57,74.8
  Top 0.6: L3.1 57,74.8 56.9,74.8
N$22  (via drill 0.3)
  Top 0.3: DRV3.11 55.99,77 | RVBST3-1.2 v57.9,69.5 | v60.5,77.9 58.5,77.9 CVBST3.1 | 55.7,76.98 DRV3.12 | 57,76.2 56.98,76.18 DRV3.10
  Top 0.6: 57,76.98 DRV3.11 55.7,76.98 | 57,76.98 57,76.2 | 57,76.98 57.87,77.85 CVBST3.1
  Bottom 0.3: v57.9,69.5 60.5,71.6 v60.5,77.9
N$23
  Top 0.3: DRV3.3 55,69.9 RVBST3-1.1 RVBST3-2.2
N$24
  Top 0.3: DRV3.15 54.01,78.44 REXT3.2
N$25
  Top 0.3: DRV3.1 52.69,71.7 CPUMP3.1
N$26
  Top 0.3: DRV3.20 48.15,74.01 CVREG3.1
N$27
  Top 0.3: DRV4.7 DRV4.8 57,54.98 57,54.8
  Top 0.6: L4.1 57,54.8 56.9,54.8
N$28  (via drill 0.3)
  Top 0.3: DRV4.11 55.99,57 | v60.5,57.9 58.5,57.9 CVBST4.1 | 55.7,56.98 DRV4.12 | 57,56.2 56.98,56.18 DRV4.10 | v57.9,49.5 RVBST4-1.2
  Top 0.6: 57,56.98 DRV4.11 55.7,56.98 | 57,56.98 57,56.2 | 57,56.98 57.87,57.85 CVBST4.1
  Bottom 0.3: v57.9,49.5 60.5,52.1 v60.5,57.9
N$29
  Top 0.3: DRV4.3 55,49.9 RVBST4-1.1 RVBST4-2.2
N$30
  Top 0.3: DRV4.15 54.01,58.44 REXT4.2
N$31
  Top 0.3: DRV4.1 52.69,51.7 CPUMP4.1
N$32
  Top 0.3: DRV4.20 48.15,54.01 CVREG4.1
N$33
  Top 0.3: DRV5.7 DRV5.8 32,34.98 32,34.8
  Top 0.6: L5.1 32,34.8 31.9,34.8
N$34  (via drill 0.3)
  Top 0.3: DRV5.11 30.99,37 | RVBST1-3.2 v32.9,29.5 | v35.5,37.9 33.5,37.9 CVBST5.1 | 30.7,36.98 DRV5.12 | 32,36.2 31.98,36.18 DRV5.10
  Top 0.6: 32,36.98 DRV5.11 30.7,36.98 | 32,36.98 32,36.2 | 32,36.98 32.87,37.85 CVBST5.1
  Bottom 0.3: v32.9,29.5 35.5,31.6 v35.5,37.9
N$35
  Top 0.3: DRV5.3 30,29.9 RVBST1-3.1 RVBST1-4.2
N$36
  Top 0.3: DRV5.15 29.01,38.44 REXT5.2
N$37
  Top 0.3: DRV5.1 27.69,31.7 CPUMP5.1
N$38
  Top 0.3: DRV5.20 23.15,34.01 CVREG5.1
N$39
  Top 0.3: DRV6.7 DRV6.8 32,14.98 32,14.8
  Top 0.6: L6.1 32,14.8 31.9,14.8
N$40  (via drill 0.3)
  Top 0.3: DRV6.11 30.99,17 | v35.5,17.9 33.5,17.9 CVBST6.1 | 30.7,16.98 DRV6.12 | 32,16.2 31.98,16.18 DRV6.10 | v32.9,9.5 RVBST2-3.2
  Top 0.6: 32,16.98 DRV6.11 30.7,16.98 | 32,16.98 32,16.2 | 32,16.98 32.87,17.85 CVBST6.1
  Bottom 0.3: v32.9,9.5 35.5,12.1 v35.5,17.9
N$41
  Top 0.3: DRV6.3 30,9.9 RVBST2-3.1 RVBST2-4.2
N$42
  Top 0.3: DRV6.15 29.01,18.44 REXT6.2
N$43
  Top 0.3: DRV6.1 27.69,11.7 CPUMP6.1
N$44
  Top 0.3: DRV6.20 23.15,14.01 CVREG6.1
N$45
  Top 0.3: DRV7.7 DRV7.8 57,34.98 57,34.8
  Top 0.6: L7.1 57,34.8 56.9,34.8
N$46  (via drill 0.3)
  Top 0.3: DRV7.11 55.99,37 | RVBST3-3.2 v57.9,29.5 | v60.5,37.9 58.5,37.9 CVBST7.1 | 55.7,36.98 DRV7.12 | 57,36.2 56.98,36.18 DRV7.10
  Top 0.6: 57,36.98 DRV7.11 55.7,36.98 | 57,36.98 57,36.2 | 57,36.98 57.87,37.85 CVBST7.1
  Bottom 0.3: v57.9,29.5 60.5,31.6 v60.5,37.9
N$47
  Top 0.3: DRV7.3 55,29.9 RVBST3-3.1 RVBST3-4.2
N$48
  Top 0.3: DRV7.15 54.01,38.44 REXT7.2
N$49
  Top 0.3: DRV7.1 52.69,31.7 CPUMP7.1
N$50
  Top 0.3: DRV7.20 48.15,34.01 CVREG7.1
N$51
  Top 0.3: DRV8.7 DRV8.8 57,14.98 57,14.8
  Top 0.6: L8.1 57,14.8 56.9,14.8
N$52  (via drill 0.3)
  Top 0.3: DRV8.11 55.99,17 | v60.5,17.9 58.5,17.9 CVBST8.1 | 55.7,16.98 DRV8.12 | 57,16.2 56.98,16.18 DRV8.10 | v57.9,9.5 RVBST4-3.2
  Top 0.6: 57,16.98 DRV8.11 55.7,16.98 | 57,16.98 57,16.2 | 57,16.98 57.87,17.85 CVBST8.1
  Bottom 0.3: v57.9,9.5 60.5,12.1 v60.5,17.9
N$53
  Top 0.3: DRV8.3 55,9.9 RVBST4-3.1 RVBST4-4.2
N$54
  Top 0.3: DRV8.15 54.01,18.44 REXT8.2
N$55
  Top 0.3: DRV8.1 52.69,11.7 CPUMP8.1
N$56
  Top 0.3: DRV8.20 48.15,14.01 CVREG8.1
SCL1  (via drill 0.3)
  Top 0.3: DRV1.18 26,75 v23.8,77.2 | v23.8,83.4 23.8,81.53 I2C1.1
  Bottom 0.3: v23.8,77.2 v23.8,83.4
SCL2  (via drill 0.3)
  Top 0.3: DRV2.18 26,55 v23.8,57.2 | v23.8,63.4 23.8,61.53 I2C2.1
  Bottom 0.3: v23.8,57.2 v23.8,63.4
SCL3  (via drill 0.3)
  Top 0.3: DRV3.18 51,75 v48.8,77.2 | v48.8,83.4 48.8,81.53 I2C3.1
  Bottom 0.3: v48.8,77.2 v48.8,83.4
SCL4  (via drill 0.3)
  Top 0.3: DRV4.18 51,55 v48.8,57.2 | v48.8,63.4 48.8,61.53 I2C4.1
  Bottom 0.3: v48.8,57.2 v48.8,63.4
SCL5  (via drill 0.3)
  Top 0.3: DRV5.18 26,35 v23.8,37.2 | v23.8,43.4 23.8,41.53 I2C5.1
  Bottom 0.3: v23.8,37.2 v23.8,43.4
SCL6  (via drill 0.3)
  Top 0.3: DRV6.18 26,15 v23.8,17.2 | v23.8,23.4 23.8,21.53 I2C6.1
  Bottom 0.3: v23.8,17.2 v23.8,23.4
SCL7  (via drill 0.3)
  Top 0.3: DRV7.18 51,35 v48.8,37.2 | v48.8,43.4 48.8,41.53 I2C7.1
  Bottom 0.3: v48.8,37.2 v48.8,43.4
SCL8  (via drill 0.3)
  Top 0.3: DRV8.18 51,15 v48.8,17.2 | v48.8,23.4 48.8,21.53 I2C8.1
  Bottom 0.3: v48.8,17.2 v48.8,23.4
SDA1  (via drill 0.3)
  Top 0.3: DRV1.19 24.91,74.49 v23.8,75.6 | v20.9,82.2 20.9,80.27 I2C1.2
  Bottom 0.3: v23.8,75.6 20.9,78.5 v20.9,82.2
SDA2  (via drill 0.3)
  Top 0.3: DRV2.19 24.91,54.49 v23.8,55.6 | v20.9,62.2 20.9,60.27 I2C2.2
  Bottom 0.3: v23.8,55.6 20.9,58.5 v20.9,62.2
SDA3  (via drill 0.3)
  Top 0.3: DRV3.19 49.91,74.49 v48.8,75.6 | v45.9,82.2 45.9,80.27 I2C3.2
  Bottom 0.3: v48.8,75.6 45.9,78.5 v45.9,82.2
SDA4  (via drill 0.3)
  Top 0.3: DRV4.19 49.91,54.49 v48.8,55.6 | v45.9,62.2 45.9,60.27 I2C4.2
  Bottom 0.3: v48.8,55.6 45.9,58.5 v45.9,62.2
SDA5  (via drill 0.3)
  Top 0.3: DRV5.19 24.91,34.49 v23.8,35.6 | v20.9,42.2 20.9,40.27 I2C5.2
  Bottom 0.3: v23.8,35.6 20.9,38.5 v20.9,42.2
SDA6  (via drill 0.3)
  Top 0.3: DRV6.19 24.91,14.49 v23.8,15.6 | v20.9,22.2 20.9,20.27 I2C6.2
  Bottom 0.3: v23.8,15.6 20.9,18.5 v20.9,22.2
SDA7  (via drill 0.3)
  Top 0.3: DRV7.19 49.91,34.49 v48.8,35.6 | v45.9,42.2 45.9,40.27 I2C7.2
  Bottom 0.3: v48.8,35.6 45.9,38.5 v45.9,42.2
SDA8  (via drill 0.3)
  Top 0.3: DRV8.19 49.91,14.49 v48.8,15.6 | v45.9,22.2 45.9,20.27 I2C8.2
  Bottom 0.3: v48.8,15.6 45.9,18.5 v45.9,22.2
V+
  Top 0.3: DRV1.2 29.49,71.74 CVDD1.1 | DRV2.2 29.49,51.74 CVDD2.1 | 27.25,65.6 18.5,65.6 18.5,45.6 27.25,45.6 | DRV3.2 54.49,71.74 CVDD3.1 | DRV4.2 54.49,51.74 CVDD4.1 | 52.25,65.6 43.5,65.6 | 43.5,45.6 52.25,45.6 | DRV5.2 29.49,31.74 CVDD5.1 | DRV6.2 29.49,11.74 CVDD6.1 | 27.25,25.6 18.5,25.6 | DRV7.2 54.49,31.74 CVDD7.1 | DRV8.2 54.49,11.74 CVDD8.1 | 52.25,25.6 43.5,25.6 18.3,25.6 18.3,23.4 | 43.5,5.6 52.25,5.6
  Top 0.6: RLED.2 5.85,75.5 DC_CONNECTOR.4 | 11.4,75.5 DC_CONNECTOR.3 | L1.2 35.2,72 35.2,65.6 | CVDD1.1 27.25,65.6 | 27.25,65.6 35.2,65.6 | 27.25,65.6 18.3,65.6 | L2.2 35.2,52 35.2,45.6 | 35.2,45.6 27.25,45.6 | 27.25,45.6 18.3,45.6 | CVDD2.1 27.25,45.6 | L3.2 60.2,72 60.2,65.6 52.25,65.6 | CVDD3.1 52.25,65.6 | 52.25,65.6 35.2,65.6 | L4.2 60.2,52 60.2,45.6 52.25,45.6 | 52.25,45.6 35.2,45.6 | CVDD4.1 52.25,45.6 | L5.2 35.2,32 35.2,25.6 | CVDD5.1 27.25,25.6 | 27.25,25.6 35.2,25.6 | 27.25,25.6 18.3,25.6 | L6.2 35.2,12 35.2,5.6 | 35.2,5.6 27.25,5.6 | 27.25,5.6 18.3,5.6 18.3,6 | CVDD6.1 27.25,5.6 | L7.2 60.2,32 60.2,25.6 52.25,25.6 | CVDD7.1 52.25,25.6 | 52.25,25.6 35.2,25.6 | L8.2 60.2,12 60.2,5.6 52.25,5.6 | 52.25,5.6 35.2,5.6 | CVDD8.1 52.25,5.6
  Top 1: DC_CONNECTOR.3 DC_CONNECTOR.4
  Top 1.6: 18.3,6 18.3,23.4 18.3,45.6 18.3,65.6 18.3,68.3 DC_CONNECTOR.3

### Text on the board
tPlace: DRV1 | DRV3 | SDA | SDA | SCL | SCL | REXT | REXT | CVBST | CVBST | L | L | CVREG | CVREG | CPUMP | R1 | CPUMP | R1 | CVDD | CVDD | 1 | R2 | R2 | 3.0 - 5.0V | 2 | DRV2 | DRV4 | 3 | SDA | SDA | 4 | SCL | SCL | REXT | REXT | + | - | OUT1-4 | CVBST | CVBST | L | L | CVREG | CVREG | CPUMP | R1 | CPUMP | R1 | CVDD | CVDD | 1- | R2 | R2 | 1+ | 2- | DRV5 | DRV7 | 2+ | SDA | SDA | SCL | SCL | 3- | REXT | REXT | 3+ | CVBST | CVBST | AHMI / 8ch piezo driver / V 1.3 - R001 / (c) ICST 2014 | L | L | 4- | 4+ | CVREG | CVREG | 5- | 5+ | CPUMP | R1 | CPUMP | R1 | CVDD | CVDD | 5 | 6- | R2 | R2 | 6 | 6+ | DRV6 | DRV8 | 7 | 7- | 7+ | SDA | SDA | 8 | SCL | SCL | REXT | REXT | + | - | 8- | OUT5-8 | 8+ | CVBST | CVBST | L | L | CVREG | CVREG | CPUMP | R1 | CPUMP | R1 | CVDD | CVDD | R2 | R2